# Altium schematic sheet Power.SchDoc
size A4; SheetNumber: 4; SheetTotal: 5
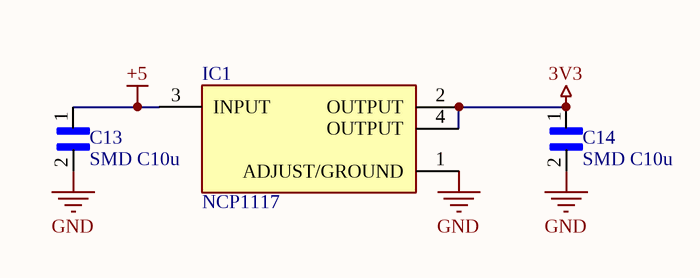
[diagram p0: Power.SchDoc]

## Parts
C13  SMD C10u  [SMD Capacetor-Footprint-1]
C14  SMD C10u  [SMD Capacetor-Footprint-1]
IC1  NCP1117  [NCP1117-Footprint-1]

## Nets
3V3: C14.1 IC1.2(OUTPUT) IC1.4(OUTPUT)
+5: C13.1 IC1.3(INPUT)
GND: C13.2 C14.2 IC1.1(ADJUST/GROUND)

## Library data of the parts
C13 C14 = CMP-00053-1: Generic SMD Capacetor
IC1 = CMP-00010-1: Voltage Stabalizer